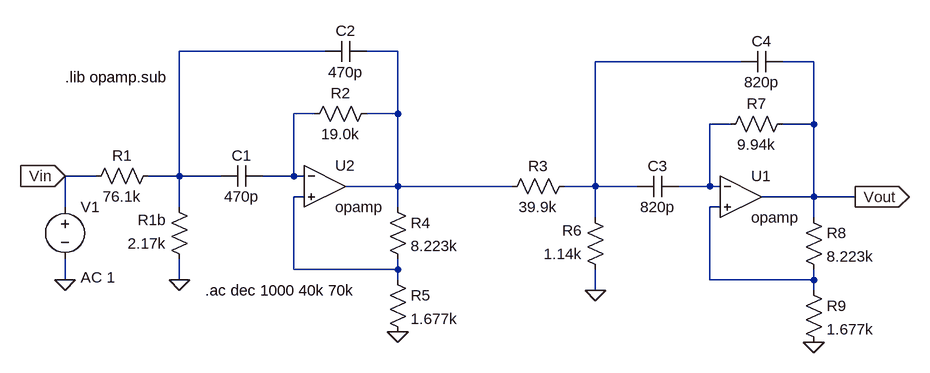
[diagram p0: schematic rauch_sim.asc]
rauch_sim.asc, the LTspice schematic file:
Version 4
SHEET 1 1440 680
WIRE 448 -32 224 -32
WIRE 560 -32 512 -32
WIRE 1088 -16 864 -16
WIRE 1200 -16 1152 -16
WIRE 432 64 400 64
WIRE 560 64 560 -32
WIRE 560 64 512 64
WIRE 1072 80 1040 80
WIRE 1200 80 1200 -16
WIRE 1200 80 1152 80
WIRE 96 160 48 160
WIRE 224 160 224 -32
WIRE 224 160 176 160
WIRE 288 160 224 160
WIRE 400 160 400 64
WIRE 400 160 352 160
WIRE 416 160 400 160
WIRE 560 176 560 64
WIRE 560 176 480 176
WIRE 736 176 560 176
WIRE 864 176 864 -16
WIRE 864 176 816 176
WIRE 928 176 864 176
WIRE 1040 176 1040 80
WIRE 1040 176 992 176
WIRE 1056 176 1040 176
WIRE 416 192 400 192
WIRE 1200 192 1200 80
WIRE 1200 192 1120 192
WIRE 1264 192 1200 192
WIRE 48 208 48 160
WIRE 224 208 224 160
WIRE 560 208 560 176
WIRE 1056 208 1040 208
WIRE 864 224 864 176
WIRE 1200 224 1200 192
WIRE 400 304 400 192
WIRE 560 304 560 288
WIRE 560 304 400 304
WIRE 48 320 48 288
WIRE 224 320 224 288
WIRE 560 320 560 304
WIRE 1040 320 1040 208
WIRE 1200 320 1200 304
WIRE 1200 320 1040 320
WIRE 864 336 864 304
WIRE 1200 336 1200 320
FLAG 224 320 0
FLAG 560 400 0
FLAG 48 320 0
FLAG 48 160 Vin
IOPIN 48 160 In
FLAG 864 336 0
FLAG 1264 192 Vout
IOPIN 1264 192 Out
FLAG 1200 416 0
SYMBOL res 192 144 R90
WINDOW 0 0 56 VBottom 2
WINDOW 3 32 56 VTop 2
SYMATTR InstName R1
SYMATTR Value 76.1k
SYMBOL res 240 304 R180
WINDOW 0 36 76 Left 2
WINDOW 3 36 40 Left 2
SYMATTR InstName R1b
SYMATTR Value 2.17k
SYMBOL res 528 48 R90
WINDOW 0 0 56 VBottom 2
WINDOW 3 32 56 VTop 2
SYMATTR InstName R2
SYMATTR Value 19.0k
SYMBOL res 544 192 R0
SYMATTR InstName R4
SYMATTR Value 8.223k
SYMBOL res 544 304 R0
SYMATTR InstName R5
SYMATTR Value 1.677k
SYMBOL cap 352 144 R90
WINDOW 0 0 32 VBottom 2
WINDOW 3 32 32 VTop 2
SYMATTR InstName C1
SYMATTR Value 470p
SYMBOL cap 512 -48 R90
WINDOW 0 0 32 VBottom 2
WINDOW 3 32 32 VTop 2
SYMATTR InstName C2
SYMATTR Value 470p
SYMBOL Opamps\\opamp 448 112 R0
SYMATTR InstName U2
SYMBOL voltage 48 192 R0
WINDOW 123 24 124 Left 2
WINDOW 39 0 0 Left 0
SYMATTR Value2 AC 1
SYMATTR InstName V1
SYMATTR Value ""
SYMBOL res 832 160 R90
WINDOW 0 0 56 VBottom 2
WINDOW 3 32 56 VTop 2
SYMATTR InstName R3
SYMATTR Value 39.9k
SYMBOL res 880 320 R180
WINDOW 0 36 76 Left 2
WINDOW 3 36 40 Left 2
SYMATTR InstName R6
SYMATTR Value 1.14k
SYMBOL res 1168 64 R90
WINDOW 0 0 56 VBottom 2
WINDOW 3 32 56 VTop 2
SYMATTR InstName R7
SYMATTR Value 9.94k
SYMBOL res 1184 208 R0
SYMATTR InstName R8
SYMATTR Value 8.223k
SYMBOL res 1184 320 R0
SYMATTR InstName R9
SYMATTR Value 1.677k
SYMBOL cap 992 160 R90
WINDOW 0 0 32 VBottom 2
WINDOW 3 32 32 VTop 2
SYMATTR InstName C3
SYMATTR Value 820p
SYMBOL cap 1152 -32 R90
WINDOW 0 0 32 VBottom 2
WINDOW 3 32 32 VTop 2
SYMATTR InstName C4
SYMATTR Value 820p
SYMBOL Opamps\\opamp 1088 128 R0
SYMATTR InstName U1
TEXT 264 336 Left 2 !.ac dec 1000 40k 70k
TEXT 48 8 Left 2 !.lib opamp.sub

The netlist it stands for:
* rauch_sim.asc
R1 N001 Vin 76.1k
R1b 0 N001 2.17k
R2 N002 N004 19.0k
R4 N002 N006 8.223k
R5 N006 0 1.677k
C1 N004 N001 470p
C2 N002 N001 470p
XU2 N004 N006 N002 opamp Aol=100K GBW=10Meg  ; pins invin noninvin out
V1 Vin 0 AC 1
R3 N003 N002 39.9k
R6 0 N003 1.14k
R7 Vout N005 9.94k
R8 Vout N007 8.223k
R9 N007 0 1.677k
C3 N005 N003 820p
C4 Vout N003 820p
XU1 N005 N007 Vout opamp Aol=100K GBW=10Meg  ; pins invin noninvin out
.ac dec 1000 40k 70k
.lib opamp.sub
.backanno
.end